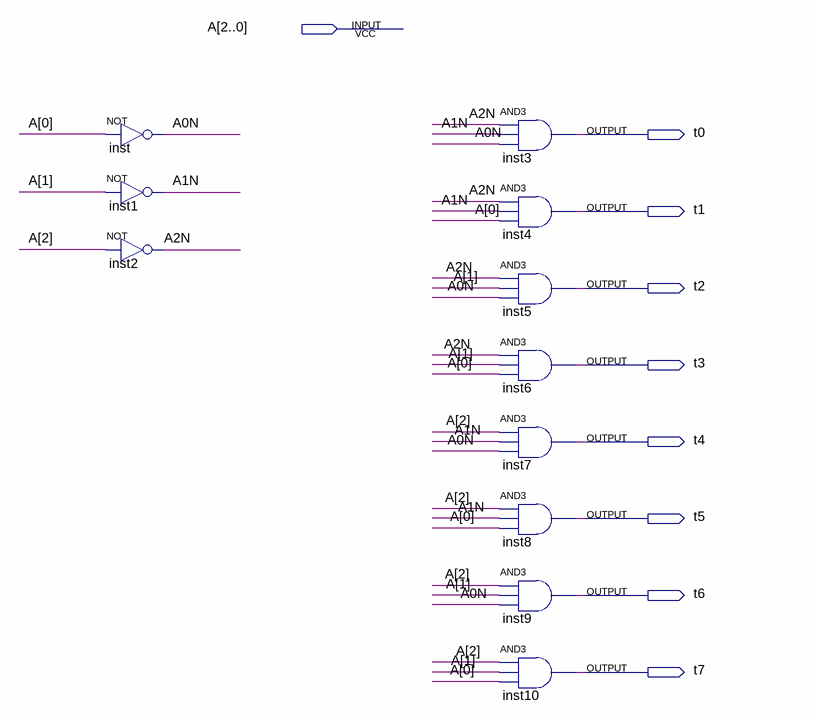
[diagram p0: schematic sheet]
// Quartus schematic DecoderTimer.bdf as structural Verilog: 11 symbols, 9 pins
module DecoderTimer (
  input  [2:0] A,
  output t0,
  output t1,
  output t2,
  output t3,
  output t4,
  output t5,
  output t6,
  output t7
);

  wire A0N, A1N, A2N;

  not inst (A0N, A[0]);
  not inst1 (A1N, A[1]);
  not inst2 (A2N, A[2]);
  and inst3 (t0, A2N, A1N, A0N);
  and inst4 (t1, A2N, A1N, A[0]);
  and inst5 (t2, A2N, A[1], A0N);
  and inst6 (t3, A2N, A[1], A[0]);
  and inst7 (t4, A[2], A1N, A0N);
  and inst8 (t5, A[2], A1N, A[0]);
  and inst9 (t6, A[2], A[1], A0N);
  and inst10 (t7, A[2], A[1], A[0]);
endmodule
